# Altium schematic sheet AnalogOut.SchDoc
size A4; CompanyName: NTB; Organization: NTB Interstate University of Applied; Address1: Werdenbergstrasse 4; Address3: 9471 Buchs; Address4: Switzerland; Organization1: Sciences of Technology Buchs; Size: A4
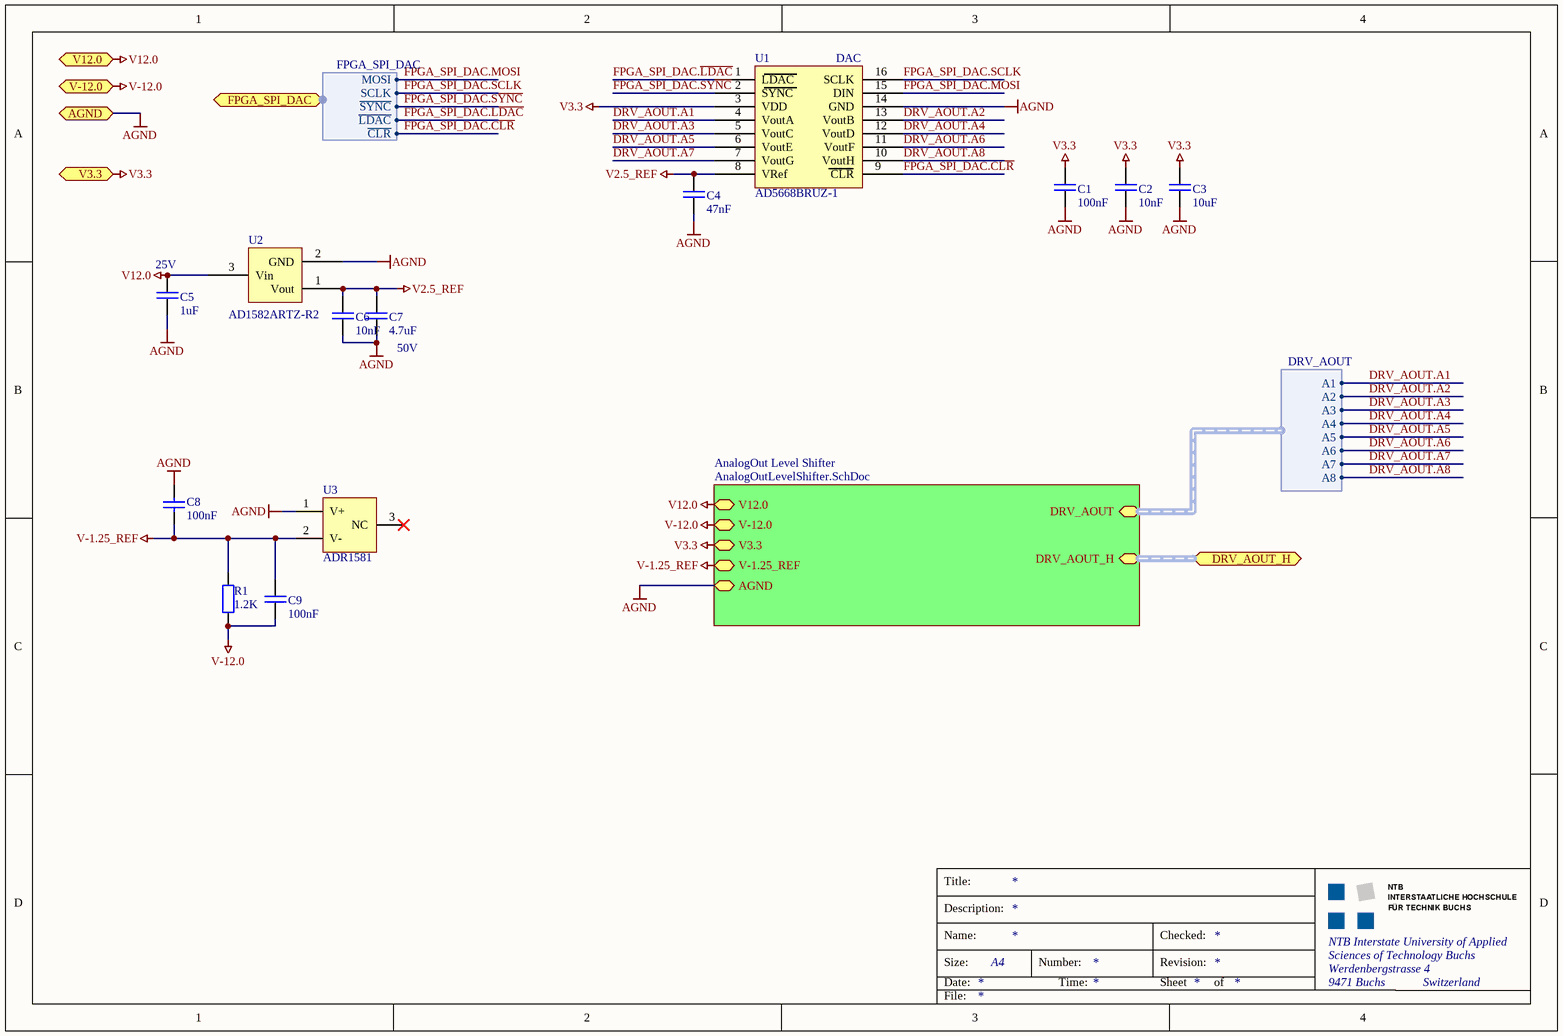
[diagram p0: AnalogOut.SchDoc]

## Parts
C1  100nF  [0603_3D]
C2  10nF  [0603_3D]
C3  10uF  [0603_3D]
C4  47nF  [0603_3D]
C5  Voltage Maximum: 25V  [0603_3D]  (hidden comment: 1uF)
C6  10nF  [0603_3D]
C7  Voltage Maximum: 50V  [1206]  (hidden comment: 4.7uF)
C8  100nF  [0603_3D]
C9  100nF  [0603_3D]
R1  1.2K  [0603]
U1  AD5668BRUZ-1  [TSSOP16-W]
U2  AD1582ARTZ-R2  [SOT23]
U3  ADR1581  [SOT23]

## Sub-sheets
AnalogOut Level Shifter = AnalogOutLevelShifter.SchDoc: DRV_AOUT_H (harness DRV_AOUT_H), V12.0, V-12.0, V3.3, AGND, V-1.25_REF, DRV_AOUT (harness DRV_AOUT)

## Ports
AGND, DRV_AOUT_H (harness DRV_AOUT_H), FPGA_SPI_DAC (harness FPGA_SPI_DAC), V3.3, V12.0, V-12.0

## Harnesses
FPGA_SPI_DAC: MOSI, SCLK, ~{SYNC}, ~{LDAC}, ~{CLR}
DRV_AOUT: A1, A2, A3, A4, A5, A6, A7, A8

## Nets
AGND: C1.2 C2.2 C3.2 C4.2 C5.1 C6.2 C7.2 C8.2 U1.14(GND) U2.2(GND) U3.1(V+) ; port AGND, sheet AnalogOut Level Shifter/AGND
V2.5_REF: C4.1 C6.1 C7.1 U1.8(VRef) U2.1(Vout)
V3.3: C1.1 C2.1 C3.1 U1.3(VDD) ; port V3.3, sheet AnalogOut Level Shifter/V3.3
V12.0: C5.2 U2.3(Vin) ; port V12.0, sheet AnalogOut Level Shifter/V12.0
V-1.25_REF: C8.1 C9.2 R1.2 U3.2(V-) ; sheet AnalogOut Level Shifter/V-1.25_REF
V-12.0: C9.1 R1.1 ; port V-12.0, sheet AnalogOut Level Shifter/V-12.0
DRV_AOUT.A1: U1.4(VoutA) ; sheet AnalogOut Level Shifter/DRV_AOUT.A1
DRV_AOUT.A2: U1.13(VoutB) ; sheet AnalogOut Level Shifter/DRV_AOUT.A2
DRV_AOUT.A3: U1.5(VoutC) ; sheet AnalogOut Level Shifter/DRV_AOUT.A3
DRV_AOUT.A4: U1.12(VoutD) ; sheet AnalogOut Level Shifter/DRV_AOUT.A4
DRV_AOUT.A5: U1.6(VoutE) ; sheet AnalogOut Level Shifter/DRV_AOUT.A5
DRV_AOUT.A6: U1.11(VoutF) ; sheet AnalogOut Level Shifter/DRV_AOUT.A6
DRV_AOUT.A7: U1.7(VoutG) ; sheet AnalogOut Level Shifter/DRV_AOUT.A7
DRV_AOUT.A8: U1.10(VoutH) ; sheet AnalogOut Level Shifter/DRV_AOUT.A8
FPGA_SPI_DAC.~{CLR}: U1.9(CLR) ; port FPGA_SPI_DAC.~{CLR}
FPGA_SPI_DAC.~{LDAC}: U1.1(LDAC) ; port FPGA_SPI_DAC.~{LDAC}
FPGA_SPI_DAC.MOSI: U1.15(DIN) ; port FPGA_SPI_DAC.MOSI
FPGA_SPI_DAC.~{SYNC}: U1.2(SYNC) ; port FPGA_SPI_DAC.~{SYNC}
FPGA_SPI_DAC.SCLK: U1.16(SCLK) ; port FPGA_SPI_DAC.SCLK

Not connected (* = marked no-connect by the designer): U3 3(NC)*

## Buses and harness runs
harness port DRV_AOUT_H = sheet AnalogOut Level Shifter/DRV_AOUT_H

## Notes on the sheet
- (near U1) DAC
- Title:
- Description:
- Size:
- Date:
- Name:
- Number:
- Time:
- Revision:
- Sheet
- Checked:
- of
- File:

## Library data of the parts
C1-C4 C6 C9 = C: Capacitor; #Manufacturer: Generic Components; #Publisher: Dr. A. Heinzelmann; #Class: Passive; Initial Voltage: 0V; Voltage Maximum: ??? V; #Published: 2006-10-07; #ClassSub: Capacitor
  C1 C9: Value: 100nF
  C2 C6: Value: 10nF
  C3: Value: 10uF
  C4: Value: 47nF
C5 C7 C8 = C: Capacitor; #Manufacturer: Generic Components; #Publisher: Dr. A. Heinzelmann; #Class: Passive; Initial Voltage: 0V; #Published: 2006-10-07; #ClassSub: Capacitor
  C5: Value: 1uF
  C7: Value: 4.7uF
  C8: Type: *; Value: 100nF; Voltage Maximum: *
R1 = R: Resistor; #Manufacturer: Generic Components; #Publisher: Dr. A. Heinzelmann; #Class: Passive; #Published: 2006-10-06; #ClassSub: Resistor; Value: 1.2K